# EAGLE schematic grubClub_v3 (EAGLE 9.6.2)
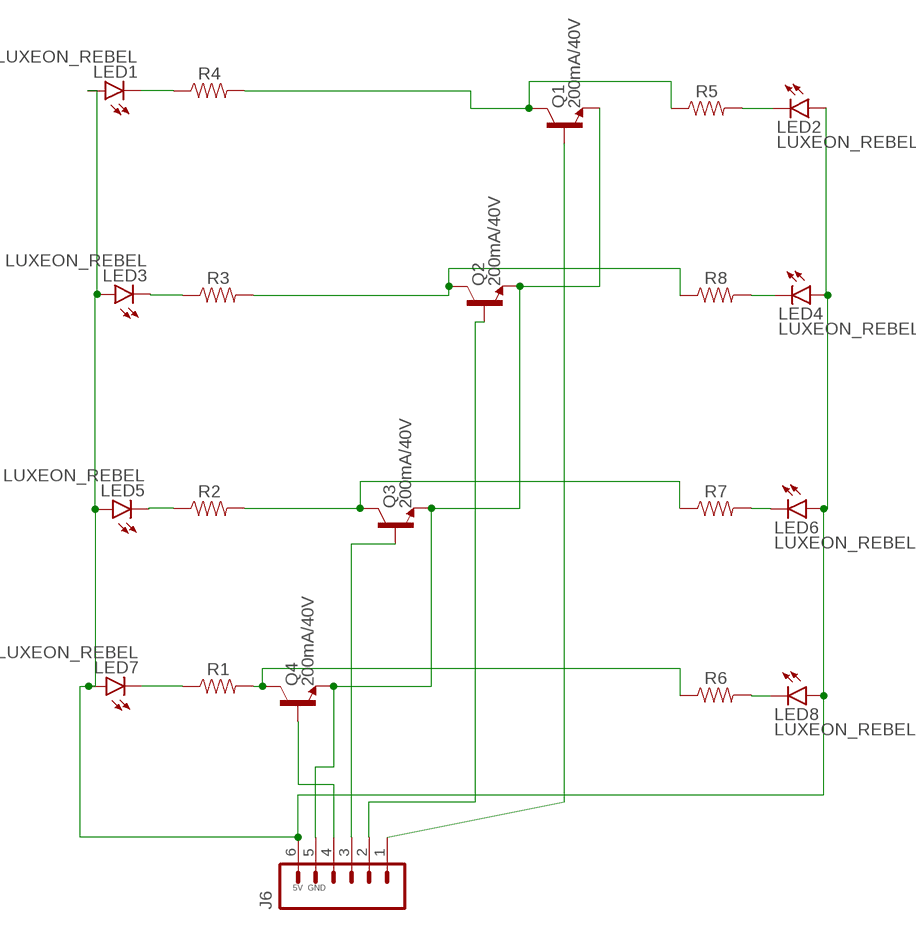
[diagram p0: schematic, sheet 1]

## Parts
J6  CONN_06SILK_FEMALE_PTH  [1X06]
LED1  LUXEON_REBEL  [LUXEON_REBEL]
LED2  LUXEON_REBEL  [LUXEON_REBEL]
LED3  LUXEON_REBEL  [LUXEON_REBEL]
LED4  LUXEON_REBEL  [LUXEON_REBEL]
LED5  LUXEON_REBEL  [LUXEON_REBEL]
LED6  LUXEON_REBEL  [LUXEON_REBEL]
LED7  LUXEON_REBEL  [LUXEON_REBEL]
LED8  LUXEON_REBEL  [LUXEON_REBEL]
Q1  200mA/40V  TRANS_NPN-2N3904  [TO-92]
Q2  200mA/40V  TRANS_NPN-2N3904  [TO-92]
Q3  200mA/40V  TRANS_NPN-2N3904  [TO-92]
Q4  200mA/40V  TRANS_NPN-2N3904  [TO-92]
R1  RESISTORAXIAL-0.3  [AXIAL-0.3]
R2  RESISTORAXIAL-0.3  [AXIAL-0.3]
R3  RESISTORAXIAL-0.3  [AXIAL-0.3]
R4  RESISTORAXIAL-0.3  [AXIAL-0.3]
R5  RESISTORAXIAL-0.3  [AXIAL-0.3]
R6  RESISTORAXIAL-0.3  [AXIAL-0.3]
R7  RESISTORAXIAL-0.3  [AXIAL-0.3]
R8  RESISTORAXIAL-0.3  [AXIAL-0.3]

## Nets
N$1: LED7.C LED7.C@1(C) R1.P$1
N$2: J6.4 Q4.2(B)
N$3: J6.3 Q3.2(B)
N$4: J6.2 Q2.2(B)
N$5: J6.1 Q1.2(B)
N$6: LED1.C LED1.C@1(C) R4.P$1
N$7: J6.6 LED1.A LED1.A@1(A) LED2.A LED2.A@1(A) LED3.A LED3.A@1(A) LED4.A LED4.A@1(A) LED5.A LED5.A@1(A) LED6.A LED6.A@1(A) LED7.A LED7.A@1(A) LED8.A LED8.A@1(A)
N$8: LED3.C LED3.C@1(C) R3.P$1
N$9: LED5.C LED5.C@1(C) R2.P$1
N$10: LED8.C LED8.C@1(C) R6.P$2
N$11: LED6.C LED6.C@1(C) R7.P$2
N$12: LED4.C LED4.C@1(C) R8.P$2
N$13: LED2.C LED2.C@1(C) R5.P$2
N$14: Q1.3(C) R4.P$2 R5.P$1
N$15: Q2.3(C) R3.P$2 R8.P$1
N$16: Q3.3(C) R2.P$2 R7.P$1
N$17: Q4.3(C) R1.P$2 R6.P$1
N$18: J6.5 Q1.1(E) Q2.1(E) Q3.1(E) Q4.1(E)

## Notes on the sheet
- 5V | GND

## Power pins joined to a net without a drawn wire
TH: LED1.TH LED1.TH@1(TH) LED1.TH@2(TH) LED1.TH@3(TH) LED1.TH@4(TH) LED2.TH LED2.TH@1(TH) LED2.TH@2(TH) LED2.TH@3(TH) LED2.TH@4(TH) LED3.TH LED3.TH@1(TH) LED3.TH@2(TH) LED3.TH@3(TH) LED3.TH@4(TH) LED4.TH LED4.TH@1(TH) LED4.TH@2(TH) LED4.TH@3(TH) LED4.TH@4(TH) LED5.TH LED5.TH@1(TH) LED5.TH@2(TH) LED5.TH@3(TH) LED5.TH@4(TH) LED6.TH LED6.TH@1(TH) LED6.TH@2(TH) LED6.TH@3(TH) LED6.TH@4(TH) LED7.TH LED7.TH@1(TH) LED7.TH@2(TH) LED7.TH@3(TH) LED7.TH@4(TH) LED8.TH LED8.TH@1(TH) LED8.TH@2(TH) LED8.TH@3(TH) LED8.TH@4(TH)

## Library data of the parts
J6 = SparkFun-Connectors:CONN_06: Multi connection point. Often used as Generic Header-pin footprint for 0.1 inch spaced/style header connections On any of the 0.1 inch spaced packages, you can populate with these: Break Away Headers - Straight <https://www.sparkfun.com/products/116> (PRT-00116) Break Away Male Headers - Right Angle <https://www.sparkfun.com/products/553> (PRT-00553) Female Headers <https://www.sparkfun.com/products/115> (PRT-00115) Break Away Headers - Machine Pin <https://www.sparkfun.com/products/117> (PRT-00117) Break Away Female Headers - Swiss Machine Pin <https://www.sparkfun.com/products/743> (PRT-00743) Arduino Stackable Header - 6 Pin <https://www.sparkfun.com/products/9280> (PRT-09280) For SCREWTERMINALS and SPRING TERMINALS visit here: Screw Terimnals on SparkFun.com <https://www.sparkfun.com/search/results?term=Screw+Terminals> (5mm/3.5mm/2.54mm spacing) This device is also useful as a general connection point to wire up your design to another part of your project. Our various solder wires solder well into these plated through hole pads. Hook-Up Wire - Assortment (Stranded, 22 AWG) <https://www.sparkfun.com/products/11375> (PRT-11375) Hook-Up Wire - Assortment (Solid Core, 22 AWG) <https://www.sparkfun.com/products/11367> (PRT-11367) View the entire wire category on our website here <https://www.sparkfun.com/categories/141>; PROD_ID: CONN-08437
LED1-LED8 = led-lumiled:LUXEON_REBEL: LUXEON Rebel Display layer 93, Pins, and connect all contact points with a net. The thermal pads are defined in a separate gate with addlevel REQUEST. Draw a net named 'TH' and connect all thermal pads with it. Please read the Package's Description about DRC settings. Source: http://www.lumileds.com/pdfs/AB32.pdf; OC_FARNELL: unknown; OC_NEWARK: unknown
Q1-Q4 = SparkFun-DiscreteSemi:TRANS_NPN: NPN transistor Current controlled devices typically used to amplify current or used as a switch. BC547 - COM-08928 <http://www.sparkfun.com/products/8928> (TO-92 45V 100mA) (1.Collector 2.Base 3.Emitter) 2N3904 - COM-00521 <http://www.sparkfun.com/products/521> (TO-92 40V 200mA) (1.Emitter 2.Base 3.Collector) P2N2222A - COM-12852 <http://www.sparkfun.com/products/12852> (TO-92 40V 600mA) (1.Collector 2.Base 3.Emitter); PROD_ID: TRANS-08447
R1-R8 = SparkFun-Resistors:RESISTOR: Generic Resistor Package